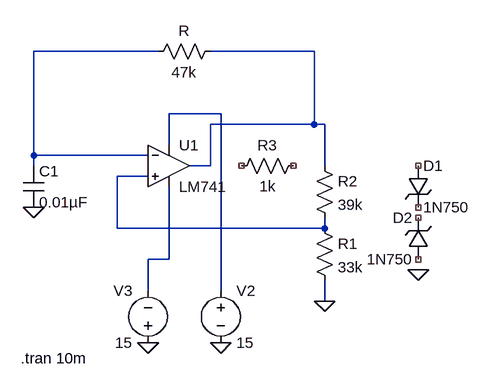
[diagram p0: schematic Lab_3_Exp_3_a.asc]
Lab_3_Exp_3_a.asc, the LTspice schematic file:
Version 4
SHEET 1 880 680
WIRE -192 -48 -384 -48
WIRE 48 -48 -112 -48
WIRE -96 48 -176 48
WIRE 48 64 48 -48
WIRE 48 64 -112 64
WIRE 64 64 48 64
WIRE -176 96 -176 48
WIRE -384 112 -384 -48
WIRE -208 112 -384 112
WIRE -384 128 -384 112
WIRE -112 128 -112 64
WIRE -112 128 -144 128
WIRE 64 128 64 64
WIRE -208 144 -256 144
WIRE -256 224 -256 144
WIRE 64 224 64 208
WIRE 64 224 -256 224
WIRE -176 272 -176 160
WIRE -176 272 -208 272
WIRE -208 320 -208 272
WIRE -96 320 -96 48
WIRE 64 336 64 304
FLAG -384 192 0
FLAG 64 336 0
FLAG 208 288 0
FLAG -208 400 0
FLAG -96 400 0
SYMBOL zener 192 128 R0
SYMATTR InstName D1
SYMATTR Value 1N750
SYMATTR Description Diode
SYMATTR Type diode
SYMBOL zener 224 272 R180
WINDOW 0 24 64 Left 2
WINDOW 3 24 0 Left 2
SYMATTR InstName D2
SYMATTR Value 1N750
SYMATTR Description Diode
SYMATTR Type diode
SYMBOL res 48 112 R0
SYMATTR InstName R2
SYMATTR Value 39k
SYMBOL res 48 208 R0
SYMATTR InstName R1
SYMATTR Value 33k
SYMBOL res 32 112 R90
WINDOW 0 0 56 VBottom 2
WINDOW 3 32 56 VTop 2
SYMATTR InstName R3
SYMATTR Value 1k
SYMBOL res -96 -64 R90
WINDOW 0 0 56 VBottom 2
WINDOW 3 32 56 VTop 2
SYMATTR InstName R
SYMATTR Value 47k
SYMBOL LM741 -176 64 R0
SYMATTR InstName U1
SYMBOL cap -400 128 R0
SYMATTR InstName C1
SYMATTR Value 0.01µF
SYMBOL voltage -96 304 R0
WINDOW 123 0 0 Left 0
WINDOW 39 0 0 Left 0
SYMATTR InstName V2
SYMATTR Value 15
SYMBOL voltage -208 416 R180
WINDOW 0 24 96 Left 2
WINDOW 3 24 16 Left 2
WINDOW 123 0 0 Left 0
WINDOW 39 0 0 Left 0
SYMATTR InstName V3
SYMATTR Value 15
TEXT -404 424 Left 2 !.tran 10m

The netlist it stands for:
* Lab_3_Exp_3_a.asc
D1 NC_01 NC_02 1N750
D2 NC_03 NC_04 1N750
R2 N002 N004 39k
R1 N004 0 33k
R3 NC_05 NC_06 1k
R N002 N001 47k
XU1 N004 N001 N003 N005 N002 LM741  ; pins In+ In- V+ V- OUT
C1 N001 0 0.01µF
V2 N003 0 15
V3 0 N005 15
.model D D
.lib standard.dio
.tran 10m
.lib LM741.lib
.backanno
.end